# Altium schematic sheet PX4FMUv2.3_SCH2.SchDoc
size A4
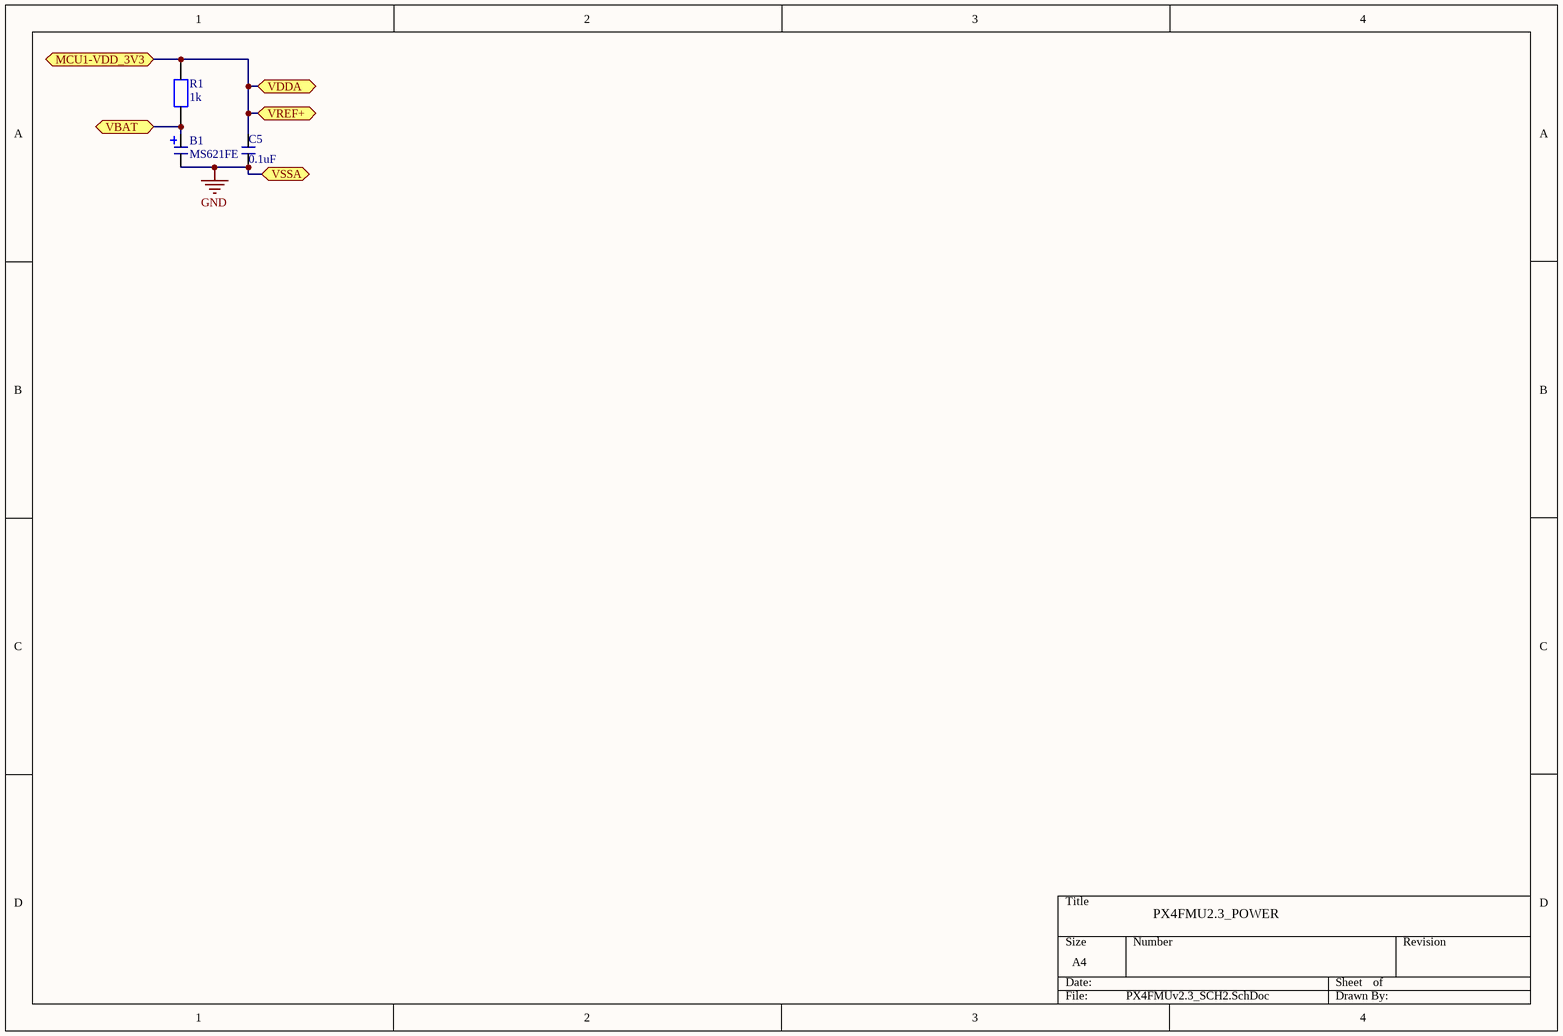
[diagram p0: PX4FMUv2.3_SCH2.SchDoc]

## Parts
B1  MS621FE  [MS621FE]
C5  0.1uF  [C 0402]
R1  1k  [0402R]

## Ports
MCU1-VDD_3V3 (bidir), VBAT (bidir), VDDA (bidir), VREF+ (bidir), VSSA (bidir)

## Nets
GND: B1.2 C5.2 ; port VSSA
MCU1-VDD_3V3: C5.1 R1.2 ; port MCU1-VDD_3V3, port VDDA, port VREF+
VBAT: B1.1 R1.1 ; port VBAT

## Notes on the sheet
- PX4FMU2.3_POWER

## Library data of the parts
C5 = CAP_0402
R1 = Res_0402